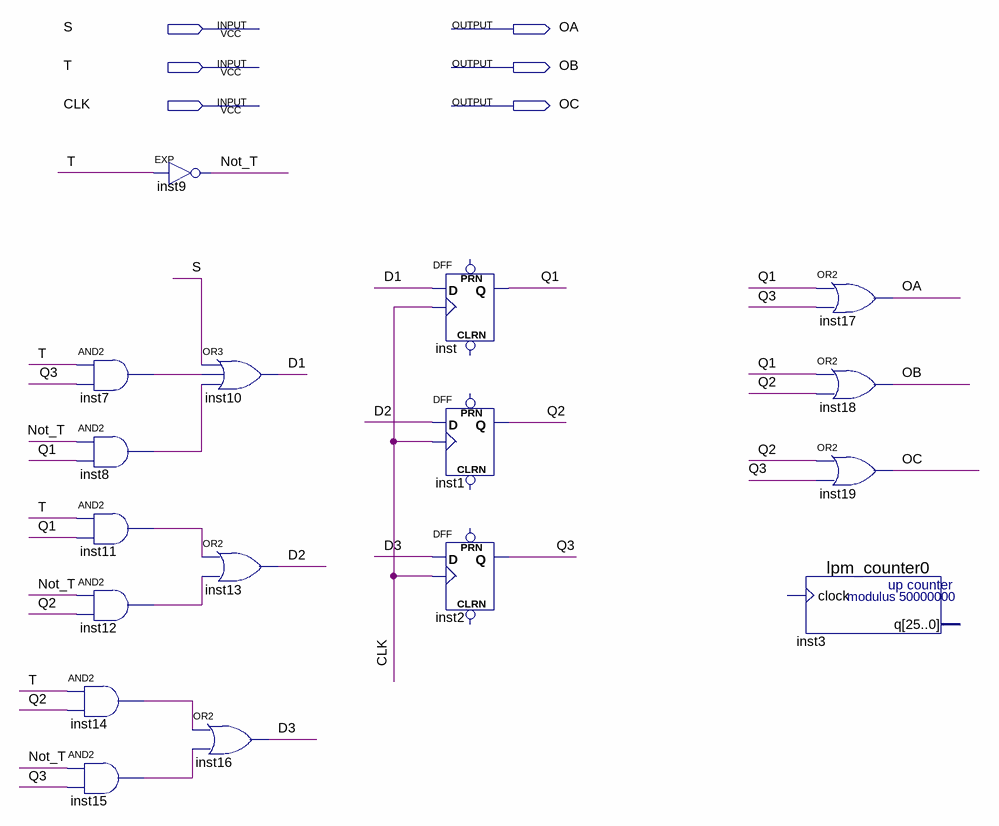
[diagram p0: schematic sheet]
// Quartus schematic StateDiagram.bdf as structural Verilog: 17 symbols, 6 pins
module StateDiagram (
  input  S,
  input  T,
  input  CLK,
  output OA,
  output OB,
  output OC
);

  wire D1, D2, D3, inst7_out, inst8_out, inst11_out, inst12_out, inst14_out, inst15_out, Not_T, Q1, Q2, Q3;

  and inst7 (inst7_out, T, Q3);
  and inst8 (inst8_out, Not_T, Q1);
  and inst11 (inst11_out, T, Q1);
  and inst12 (inst12_out, Not_T, Q2);
  and inst14 (inst14_out, T, Q2);
  and inst15 (inst15_out, Not_T, Q3);
  EXP inst9 (.IN(T), .OUT(Not_T));
  or inst10 (D1, S, inst7_out, inst8_out);
  or inst13 (D2, inst11_out, inst12_out);
  or inst16 (D3, inst14_out, inst15_out);
  DFF inst (.CLK(CLK), .D(D1), .Q(Q1));  // open: CLRN, PRN
  DFF inst1 (.CLK(CLK), .D(D2), .Q(Q2));  // open: CLRN, PRN
  DFF inst2 (.CLK(CLK), .D(D3), .Q(Q3));  // open: CLRN, PRN
  lpm_counter0 inst3 ();  // open: clock, q
  or inst17 (OA, Q1, Q3);
  or inst18 (OB, Q1, Q2);
  or inst19 (OC, Q2, Q3);
endmodule
